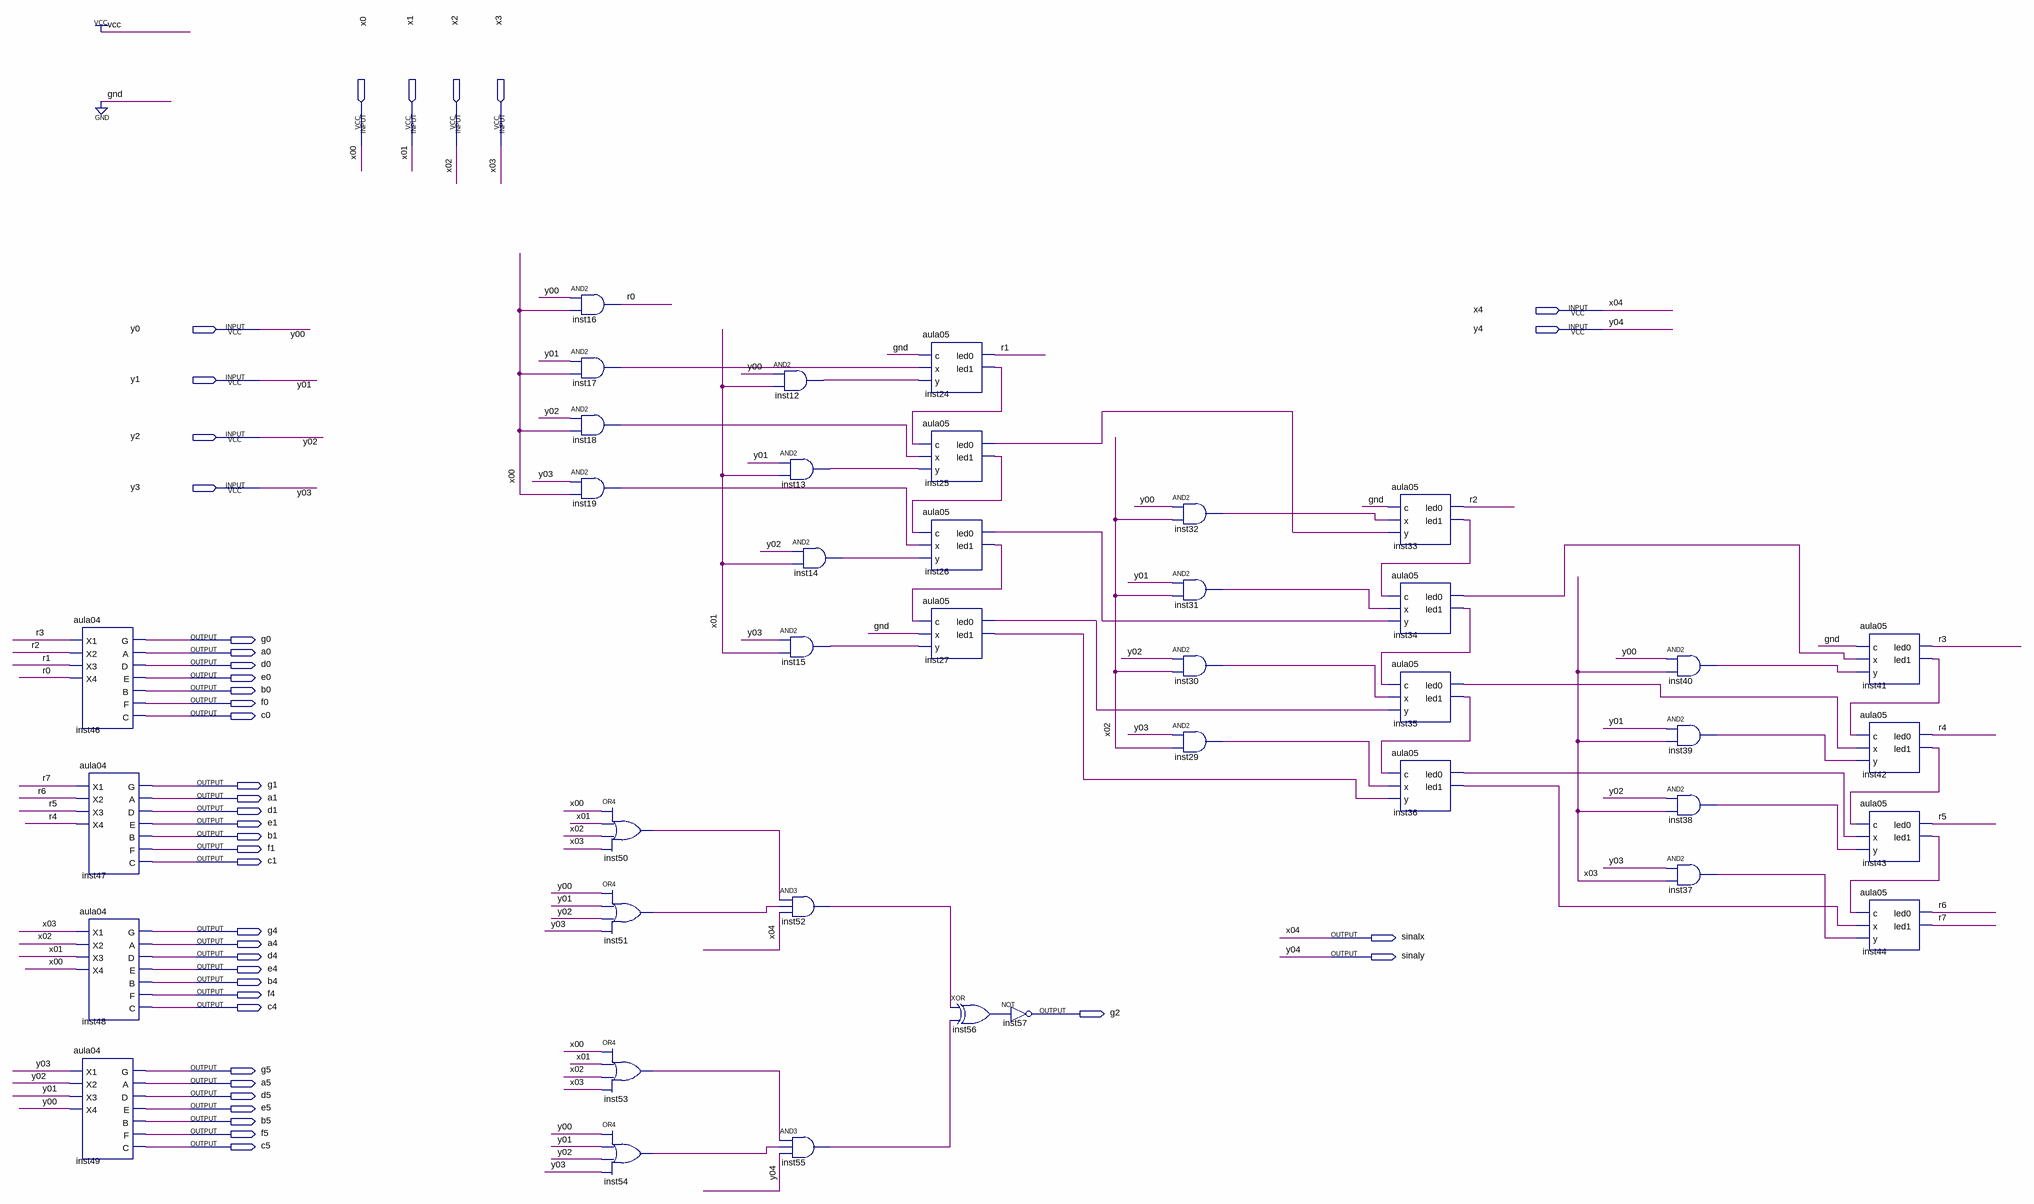
[diagram p0: schematic sheet]
// Quartus schematic aula10.bdf as structural Verilog: 40 symbols, 41 pins
module aula10 (
  input  x0,
  input  x1,
  input  x2,
  input  x3,
  input  x4,
  input  y0,
  input  y4,
  input  y1,
  input  y2,
  input  y3,
  output g0,
  output a0,
  output d0,
  output e0,
  output b0,
  output f0,
  output c0,
  output g1,
  output a1,
  output d1,
  output e1,
  output b1,
  output f1,
  output c1,
  output g4,
  output sinalx,
  output a4,
  output d4,
  output sinaly,
  output e4,
  output b4,
  output f4,
  output c4,
  output g2,
  output g5,
  output a5,
  output d5,
  output e5,
  output b5,
  output f5,
  output c5
);

  wire inst12_out, inst13_out, inst14_out, inst15_out, inst17_out, inst18_out, inst19_out, inst24_led1,
       inst25_led0, inst25_led1, inst26_led0, inst26_led1, inst27_led0, inst27_led1, inst29_out, inst30_out,
       inst31_out, inst32_out, inst33_led1, inst34_led0, inst34_led1, inst35_led0, inst35_led1, inst36_led0,
       inst36_led1, inst37_out, inst38_out, inst39_out, inst40_out, inst41_led1, inst42_led1, inst43_led1,
       inst50_out, inst51_out, inst52_out, inst53_out, inst54_out, inst55_out, inst56_out, r0, r1, r2, r3,
       r4, r5, r6, r7;

  aula04 inst46 (.X1(r3), .X2(r2), .X3(r1), .X4(r0), .G(g0), .A(a0), .D(d0), .E(e0), .B(b0), .F(f0), .C(c0));
  aula04 inst47 (.X1(r7), .X2(r6), .X3(r5), .X4(r4), .G(g1), .A(a1), .D(d1), .E(e1), .B(b1), .F(f1), .C(c1));
  aula04 inst48 (.X1(x3), .X2(x2), .X3(x1), .X4(x0), .G(g4), .A(a4), .D(d4), .E(e4), .B(b4), .F(f4), .C(c4));
  aula04 inst49 (.X1(y3), .X2(y2), .X3(y1), .X4(y0), .G(g5), .A(a5), .D(d5), .E(e5), .B(b5), .F(f5), .C(c5));
  and inst16 (r0, y0, x0);
  and inst17 (inst17_out, y1, x0);
  and inst18 (inst18_out, y2, x0);
  and inst19 (inst19_out, y3, x0);
  or inst50 (inst50_out, x0, x1, x2, x3);
  or inst51 (inst51_out, y0, y1, y2, y3);
  or inst53 (inst53_out, x0, x1, x2, x3);
  or inst54 (inst54_out, y0, y1, y2, y3);
  and inst12 (inst12_out, y0, x1);
  and inst13 (inst13_out, y1, x1);
  and inst14 (inst14_out, y2, x1);
  and inst15 (inst15_out, y3, x1);
  and inst52 (inst52_out, inst50_out, inst51_out, x4);
  and inst55 (inst55_out, inst53_out, inst54_out, y4);
  aula05 inst24 (.c(1'b0), .x(inst17_out), .y(inst12_out), .led0(r1), .led1(inst24_led1));
  aula05 inst25 (.c(inst24_led1), .x(inst18_out), .y(inst13_out), .led0(inst25_led0), .led1(inst25_led1));
  aula05 inst26 (.c(inst25_led1), .x(inst19_out), .y(inst14_out), .led0(inst26_led0), .led1(inst26_led1));
  aula05 inst27 (.c(inst26_led1), .x(1'b0), .y(inst15_out), .led0(inst27_led0), .led1(inst27_led1));
  xor inst56 (inst56_out, inst52_out, inst55_out);
  not inst57 (g2, inst56_out);
  and inst32 (inst32_out, y0, x2);
  and inst31 (inst31_out, y1, x2);
  and inst30 (inst30_out, y2, x2);
  and inst29 (inst29_out, y3, x2);
  aula05 inst33 (.c(1'b0), .x(inst32_out), .y(inst25_led0), .led0(r2), .led1(inst33_led1));
  aula05 inst34 (.c(inst33_led1), .x(inst31_out), .y(inst26_led0), .led0(inst34_led0), .led1(inst34_led1));
  aula05 inst35 (.c(inst34_led1), .x(inst30_out), .y(inst27_led0), .led0(inst35_led0), .led1(inst35_led1));
  aula05 inst36 (.c(inst35_led1), .x(inst29_out), .y(inst27_led1), .led0(inst36_led0), .led1(inst36_led1));
  and inst40 (inst40_out, y0, x3);
  and inst39 (inst39_out, y1, x3);
  and inst38 (inst38_out, y2, x3);
  and inst37 (inst37_out, y3, x3);
  aula05 inst41 (.c(1'b0), .x(inst34_led0), .y(inst40_out), .led0(r3), .led1(inst41_led1));
  aula05 inst42 (.c(inst41_led1), .x(inst35_led0), .y(inst39_out), .led0(r4), .led1(inst42_led1));
  aula05 inst43 (.c(inst42_led1), .x(inst36_led0), .y(inst38_out), .led0(r5), .led1(inst43_led1));
  aula05 inst44 (.c(inst43_led1), .x(inst36_led1), .y(inst37_out), .led0(r6), .led1(r7));

  assign sinalx = x4;
  assign sinaly = y4;

  // Other names for the same wires on the sheet: x00 = x0; x01 = x1; x02 = x2; x03 = x3; x04 = x4; y00 = y0; y01 = y1;
  //   y02 = y2; y03 = y3; y04 = y4
endmodule
